# EAGLE design I2C_T (EAGLE 7.6.0)
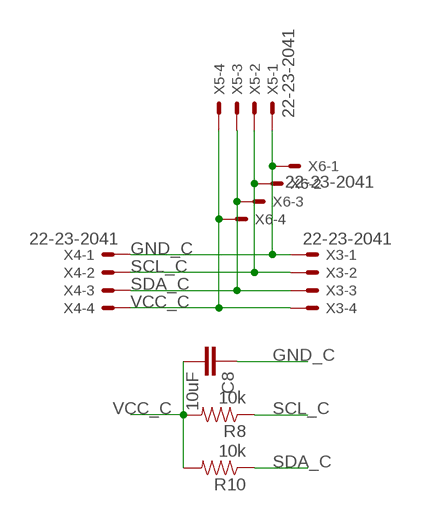
[diagram p0: schematic, sheet 1]

## Parts
C8  10uF  10UF10V10%(0805)  [0805-CAP]
R8  10k  0.3OHM-1/8W-1%(0805)  [0805]
R10  10k  0.3OHM-1/8W-1%(0805)  [0805]
X3  22-23-2041  [22-23-2041]
X4  22-23-2041  [22-23-2041]
X5  22-23-2041  [22-23-2041]
X6  22-23-2041  [22-23-2041]

## Nets
GND_C: C8.1 X3.1 X4.1 X5.1 X6.1
SCL_C: R8.1 X3.2 X4.2 X5.2 X6.2
SDA_C: R10.1 X3.3 X4.3 X5.3 X6.3
VCC_C: C8.2 R8.2 R10.2 X3.4 X4.4 X5.4 X6.4

## Library data of the parts
C8 = SparkFun-Capacitors:10UF10V10%(0805): CAP-11330; PROD_ID: CAP-11330
R8 R10 = SparkFun-Resistors:0.3OHM-1/8W-1%(0805): RES-11622; PROD_ID: RES-11622; VALUE: 0.3
X3-X6 = con-molex:22-23-2041: .100" (2.54mm) Center Header - 4 Pin; MF: MOLEX; MPN: 22-23-2041; OC_FARNELL: 1462920; OC_NEWARK: 38C0355

## Board
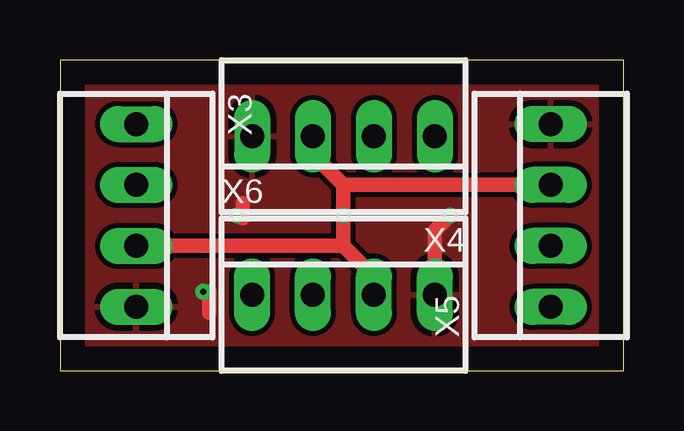
[diagram p1: board, top side]
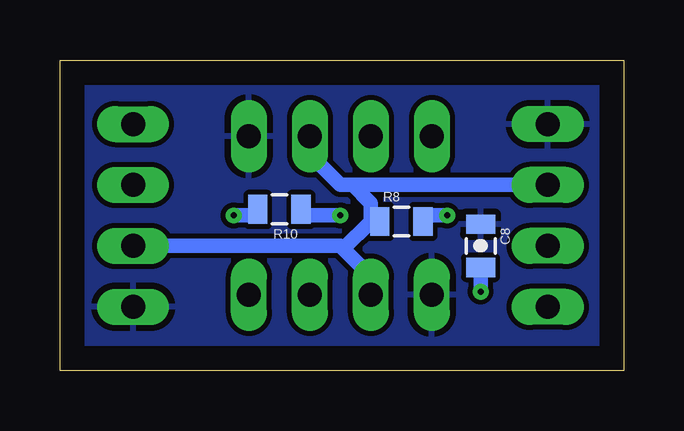
[diagram p2: board, bottom side, seen from below]

Size 23.5 x 12.95 mm. Coordinates in mm from the lower left corner, seen from the top.
Outline: 0,0 23.5,0 23.5,12.95 0,12.95 0,0
Copper layers (1*16): Top 0.035mm / dielectric 1.5mm / Bottom 0.035mm
Design rules "default": minimum track width 10mil, minimum drill 24mil, track to track 8mil, track to pad 8mil, pad to pad 8mil, via to via 8mil, smd to smd 8mil, copper to edge 40mil, drill to drill 8mil, minimum pad ring 10mil, minimum via ring 8mil, stop-mask expansion 4mil, vias tented up to drill 0mil, thermal gap 10mil

### Footprints (pad centres in the part's own frame; a part is rotated, then mirrored left to right if it is on the bottom)
0805-CAP = smd 0.8 x 1.2: 1 -0.9,0; 2 0.9,0
0805 = smd 0.8 x 1.2: 1 -0.9,0; 2 0.9,0
22-23-2041 = drill 1 long: 1 -3.81,0; 2 -1.27,0; 3 1.27,0; 4 3.81,0

### Placement (x,y rotation side)
C8  5.97,5.21 270 bottom
R8  9.27,6.22 0 bottom
R10  14.35,6.73 180 bottom
X3  3.17,6.48 270 top
X4  11.81,9.78 180 top
X5  20.45,6.48 90 top
X6  11.81,3.17 0 top

### Tracks (layer width: path | path; a pad name or v marks a point on that pad's centre or on a via)
GND_C
  pour Bottom: 0,12.95 23.5,12.95 23.5,0 0,0
SCL_C
  Bottom 0.61: X4.2 13.08,9.02 11.81,7.75 11.3,7.75 | 11.3,7.75 X3.2 | X5.2 11.81,5.21 11.68,5.08 | 11.68,5.08 10.54,3.94 X6.2 | R8.1 10.54,6.22 | 10.54,6.22 11.68,5.08 | 10.54,6.22 10.54,6.99 11.3,7.75
SDA_C  (via drill 0.25)
  Top 0.61: X3.3 11.81,5.21 | 11.81,5.21 13.08,3.94 X6.3 | X4.3 10.54,9.02 11.81,7.75 | 11.81,7.75 X5.3 | 11.81,7.75 v11.81,6.48 11.81,5.21
  Bottom 0.61: R10.1 13.2,6.48 v11.81,6.48
VCC_C  (via drill 0.25)
  Top 0.61: v16.26,6.48 15.62,5.84 X6.4 | v7.37,6.48 7.62,6.35 7.62,6.99 | v5.97,3.3 6.22,3.3 6.22,2.41
  Bottom 0.61: R10.2 15.51,6.48 v16.26,6.48 | R8.2 8.12,6.48 v7.37,6.48 | C8.2 v5.97,3.3
  pour Top: 0,0 23.62,0 23.62,12.95 0,12.95